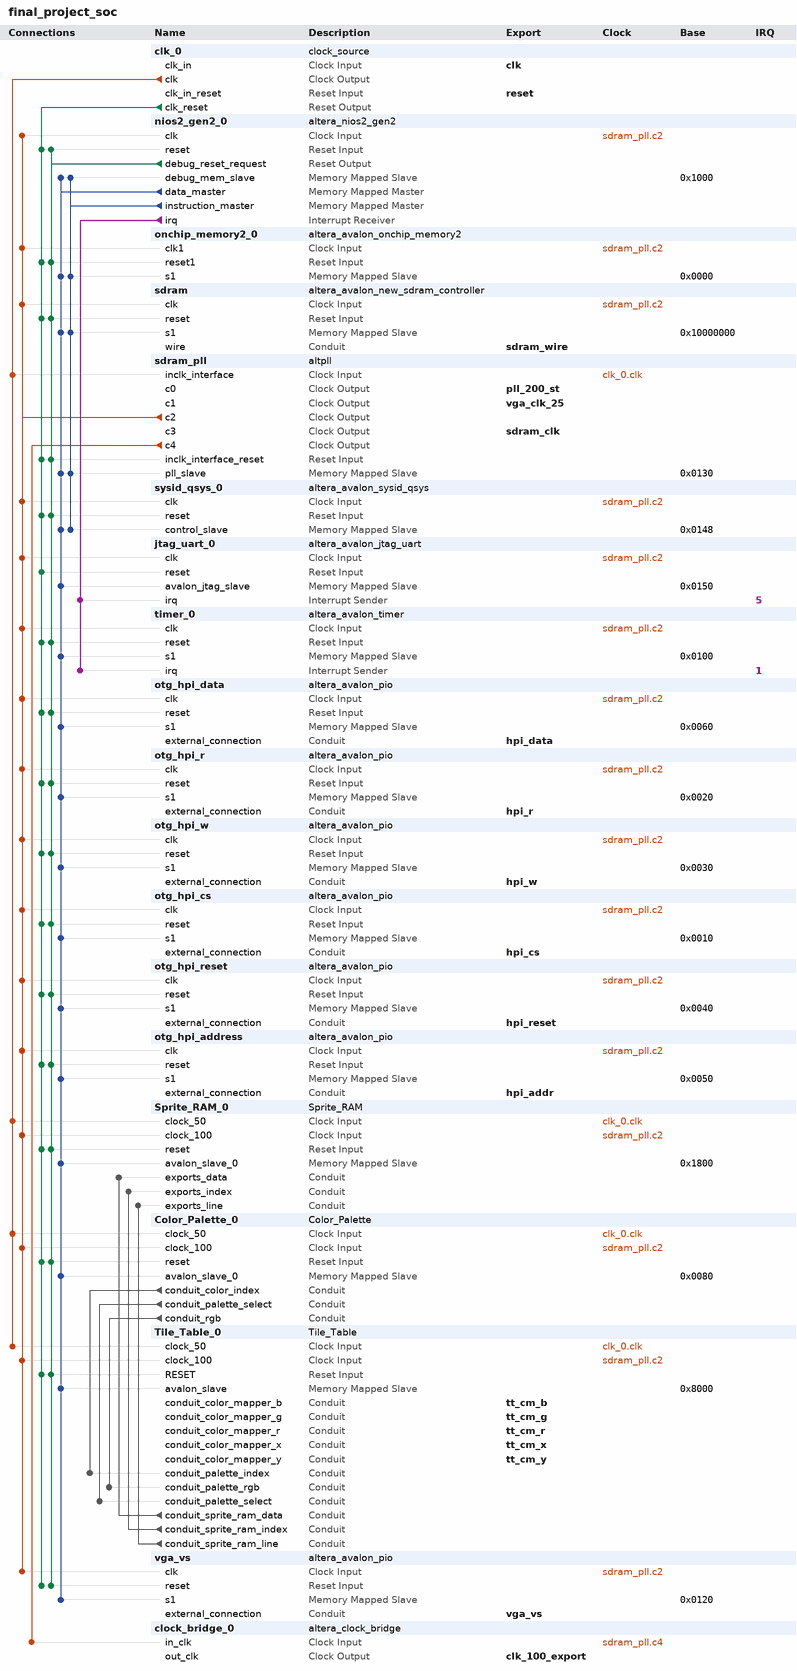
[diagram p0: system contents]
# Platform Designer (Qsys) system final_project_soc, Cyclone IV E EP4CE115F29C7
# Parameters at their usual value, and those the tool derives, are not listed.
package require -exact qsys 19.1
create_system final_project_soc
set_project_property DEVICE_FAMILY {Cyclone IV E}
set_project_property DEVICE EP4CE115F29C7

add_instance clk_0 clock_source 19.1
set_instance_parameter_value clk_0 clockFrequency 50000000

add_instance nios2_gen2_0 altera_nios2_gen2 19.1
set_instance_parameter_value nios2_gen2_0 dcache_size 2048
set_instance_parameter_value nios2_gen2_0 dividerType srt2
set_instance_parameter_value nios2_gen2_0 exceptionSlave sdram.s1
set_instance_parameter_value nios2_gen2_0 icache_size 4096
set_instance_parameter_value nios2_gen2_0 impl Fast
set_instance_parameter_value nios2_gen2_0 resetSlave sdram.s1

add_instance onchip_memory2_0 altera_avalon_onchip_memory2 19.1
set_instance_parameter_value onchip_memory2_0 dataWidth 32
set_instance_parameter_value onchip_memory2_0 dualPort false
set_instance_parameter_value onchip_memory2_0 initMemContent true
set_instance_parameter_value onchip_memory2_0 initializationFileName onchip_mem.hex
set_instance_parameter_value onchip_memory2_0 memorySize 16

add_instance sdram altera_avalon_new_sdram_controller 19.1
set_instance_parameter_value sdram TAC 5.5
set_instance_parameter_value sdram TRCD 20.0
set_instance_parameter_value sdram TRP 20.0
set_instance_parameter_value sdram casLatency 3
set_instance_parameter_value sdram columnWidth 10
set_instance_parameter_value sdram dataWidth 32
set_instance_parameter_value sdram generateSimulationModel false
set_instance_parameter_value sdram model single_Micron_MT48LC4M32B2_7_chip
set_instance_parameter_value sdram numberOfBanks 4
set_instance_parameter_value sdram numberOfChipSelects 1
set_instance_parameter_value sdram powerUpDelay 200.0
set_instance_parameter_value sdram refreshPeriod 7.8125
set_instance_parameter_value sdram rowWidth 13

add_instance sdram_pll altpll 19.1
set_instance_parameter_value sdram_pll CLK0_DIVIDE_BY 1
set_instance_parameter_value sdram_pll CLK0_MULTIPLY_BY 4
set_instance_parameter_value sdram_pll CLK1_DIVIDE_BY 2
set_instance_parameter_value sdram_pll CLK1_DUTY_CYCLE 50
set_instance_parameter_value sdram_pll CLK1_MULTIPLY_BY 1
set_instance_parameter_value sdram_pll CLK1_PHASE_SHIFT 0
set_instance_parameter_value sdram_pll CLK2_DIVIDE_BY 1
set_instance_parameter_value sdram_pll CLK2_DUTY_CYCLE 50
set_instance_parameter_value sdram_pll CLK2_MULTIPLY_BY 2
set_instance_parameter_value sdram_pll CLK2_PHASE_SHIFT 0
set_instance_parameter_value sdram_pll CLK3_DIVIDE_BY 1
set_instance_parameter_value sdram_pll CLK3_DUTY_CYCLE 50
set_instance_parameter_value sdram_pll CLK3_MULTIPLY_BY 2
set_instance_parameter_value sdram_pll CLK3_PHASE_SHIFT -1500
set_instance_parameter_value sdram_pll CLK4_DIVIDE_BY 1
set_instance_parameter_value sdram_pll CLK4_DUTY_CYCLE 50
set_instance_parameter_value sdram_pll CLK4_MULTIPLY_BY 2
set_instance_parameter_value sdram_pll CLK4_PHASE_SHIFT 0
set_instance_parameter_value sdram_pll INCLK0_INPUT_FREQUENCY 20000
set_instance_parameter_value sdram_pll PORT_ARESET PORT_UNUSED
set_instance_parameter_value sdram_pll PORT_LOCKED PORT_UNUSED
set_instance_parameter_value sdram_pll PORT_clk1 PORT_USED
set_instance_parameter_value sdram_pll PORT_clk2 PORT_USED
set_instance_parameter_value sdram_pll PORT_clk3 PORT_USED
set_instance_parameter_value sdram_pll PORT_clk4 PORT_USED

add_instance sysid_qsys_0 altera_avalon_sysid_qsys 19.1
set_instance_parameter_value sysid_qsys_0 id 0

add_instance jtag_uart_0 altera_avalon_jtag_uart 19.1
set_instance_parameter_value jtag_uart_0 simInteractiveOptions NO_INTERACTIVE_WINDOWS

add_instance timer_0 altera_avalon_timer 19.1
set_instance_parameter_value timer_0 period 1
set_instance_parameter_value timer_0 periodUnits MSEC

add_instance otg_hpi_data altera_avalon_pio 19.1
set_instance_parameter_value otg_hpi_data direction InOut
set_instance_parameter_value otg_hpi_data width 16

add_instance otg_hpi_r altera_avalon_pio 19.1
set_instance_parameter_value otg_hpi_r direction Output
set_instance_parameter_value otg_hpi_r width 1

add_instance otg_hpi_w altera_avalon_pio 19.1
set_instance_parameter_value otg_hpi_w direction Output
set_instance_parameter_value otg_hpi_w width 1

add_instance otg_hpi_cs altera_avalon_pio 19.1
set_instance_parameter_value otg_hpi_cs direction Output
set_instance_parameter_value otg_hpi_cs width 1

add_instance otg_hpi_reset altera_avalon_pio 19.1
set_instance_parameter_value otg_hpi_reset direction Output
set_instance_parameter_value otg_hpi_reset width 1

add_instance otg_hpi_address altera_avalon_pio 19.1
set_instance_parameter_value otg_hpi_address direction Output
set_instance_parameter_value otg_hpi_address width 2

add_instance Sprite_RAM_0 Sprite_RAM 1.0

add_instance Color_Palette_0 Color_Palette 1.0

add_instance Tile_Table_0 Tile_Table 1.0

add_instance vga_vs altera_avalon_pio 19.1
set_instance_parameter_value vga_vs captureEdge true
set_instance_parameter_value vga_vs direction Input
set_instance_parameter_value vga_vs width 1

add_instance clock_bridge_0 altera_clock_bridge 19.1
set_instance_parameter_value clock_bridge_0 DERIVED_CLOCK_RATE 100000000
set_instance_parameter_value clock_bridge_0 EXPLICIT_CLOCK_RATE 100000000

# connections
add_connection clk_0.clk Color_Palette_0.clock_50 clock
add_connection clk_0.clk sdram_pll.inclk_interface clock
add_connection clk_0.clk Sprite_RAM_0.clock_50 clock
add_connection clk_0.clk Tile_Table_0.clock_50 clock
add_connection sdram_pll.c2 Color_Palette_0.clock_100 clock
add_connection sdram_pll.c2 jtag_uart_0.clk clock
add_connection sdram_pll.c2 nios2_gen2_0.clk clock
add_connection sdram_pll.c2 onchip_memory2_0.clk1 clock
add_connection sdram_pll.c2 otg_hpi_address.clk clock
add_connection sdram_pll.c2 otg_hpi_cs.clk clock
add_connection sdram_pll.c2 otg_hpi_data.clk clock
add_connection sdram_pll.c2 otg_hpi_r.clk clock
add_connection sdram_pll.c2 otg_hpi_reset.clk clock
add_connection sdram_pll.c2 otg_hpi_w.clk clock
add_connection sdram_pll.c2 sdram.clk clock
add_connection sdram_pll.c2 Sprite_RAM_0.clock_100 clock
add_connection sdram_pll.c2 sysid_qsys_0.clk clock
add_connection sdram_pll.c2 Tile_Table_0.clock_100 clock
add_connection sdram_pll.c2 timer_0.clk clock
add_connection sdram_pll.c2 vga_vs.clk clock
add_connection sdram_pll.c4 clock_bridge_0.in_clk clock
add_connection clk_0.clk_reset Color_Palette_0.reset reset
add_connection clk_0.clk_reset jtag_uart_0.reset reset
add_connection clk_0.clk_reset nios2_gen2_0.reset reset
add_connection clk_0.clk_reset onchip_memory2_0.reset1 reset
add_connection clk_0.clk_reset otg_hpi_address.reset reset
add_connection clk_0.clk_reset otg_hpi_cs.reset reset
add_connection clk_0.clk_reset otg_hpi_data.reset reset
add_connection clk_0.clk_reset otg_hpi_r.reset reset
add_connection clk_0.clk_reset otg_hpi_reset.reset reset
add_connection clk_0.clk_reset otg_hpi_w.reset reset
add_connection clk_0.clk_reset sdram.reset reset
add_connection clk_0.clk_reset sdram_pll.inclk_interface_reset reset
add_connection clk_0.clk_reset Sprite_RAM_0.reset reset
add_connection clk_0.clk_reset sysid_qsys_0.reset reset
add_connection clk_0.clk_reset Tile_Table_0.RESET reset
add_connection clk_0.clk_reset timer_0.reset reset
add_connection clk_0.clk_reset vga_vs.reset reset
add_connection nios2_gen2_0.debug_reset_request Color_Palette_0.reset reset
add_connection nios2_gen2_0.debug_reset_request nios2_gen2_0.reset reset
add_connection nios2_gen2_0.debug_reset_request onchip_memory2_0.reset1 reset
add_connection nios2_gen2_0.debug_reset_request otg_hpi_address.reset reset
add_connection nios2_gen2_0.debug_reset_request otg_hpi_cs.reset reset
add_connection nios2_gen2_0.debug_reset_request otg_hpi_data.reset reset
add_connection nios2_gen2_0.debug_reset_request otg_hpi_r.reset reset
add_connection nios2_gen2_0.debug_reset_request otg_hpi_reset.reset reset
add_connection nios2_gen2_0.debug_reset_request otg_hpi_w.reset reset
add_connection nios2_gen2_0.debug_reset_request sdram.reset reset
add_connection nios2_gen2_0.debug_reset_request sdram_pll.inclk_interface_reset reset
add_connection nios2_gen2_0.debug_reset_request Sprite_RAM_0.reset reset
add_connection nios2_gen2_0.debug_reset_request sysid_qsys_0.reset reset
add_connection nios2_gen2_0.debug_reset_request Tile_Table_0.RESET reset
add_connection nios2_gen2_0.debug_reset_request timer_0.reset reset
add_connection nios2_gen2_0.debug_reset_request vga_vs.reset reset
add_connection nios2_gen2_0.data_master Color_Palette_0.avalon_slave_0 avalon
set_connection_parameter_value nios2_gen2_0.data_master/Color_Palette_0.avalon_slave_0 baseAddress 0x0080
add_connection nios2_gen2_0.data_master jtag_uart_0.avalon_jtag_slave avalon
set_connection_parameter_value nios2_gen2_0.data_master/jtag_uart_0.avalon_jtag_slave baseAddress 0x0150
add_connection nios2_gen2_0.data_master nios2_gen2_0.debug_mem_slave avalon
set_connection_parameter_value nios2_gen2_0.data_master/nios2_gen2_0.debug_mem_slave baseAddress 0x1000
add_connection nios2_gen2_0.data_master onchip_memory2_0.s1 avalon
set_connection_parameter_value nios2_gen2_0.data_master/onchip_memory2_0.s1 baseAddress 0x0000
add_connection nios2_gen2_0.data_master otg_hpi_address.s1 avalon
set_connection_parameter_value nios2_gen2_0.data_master/otg_hpi_address.s1 baseAddress 0x0050
add_connection nios2_gen2_0.data_master otg_hpi_cs.s1 avalon
set_connection_parameter_value nios2_gen2_0.data_master/otg_hpi_cs.s1 baseAddress 0x0010
add_connection nios2_gen2_0.data_master otg_hpi_data.s1 avalon
set_connection_parameter_value nios2_gen2_0.data_master/otg_hpi_data.s1 baseAddress 0x0060
add_connection nios2_gen2_0.data_master otg_hpi_r.s1 avalon
set_connection_parameter_value nios2_gen2_0.data_master/otg_hpi_r.s1 baseAddress 0x0020
add_connection nios2_gen2_0.data_master otg_hpi_reset.s1 avalon
set_connection_parameter_value nios2_gen2_0.data_master/otg_hpi_reset.s1 baseAddress 0x0040
add_connection nios2_gen2_0.data_master otg_hpi_w.s1 avalon
set_connection_parameter_value nios2_gen2_0.data_master/otg_hpi_w.s1 baseAddress 0x0030
add_connection nios2_gen2_0.data_master sdram.s1 avalon
set_connection_parameter_value nios2_gen2_0.data_master/sdram.s1 baseAddress 0x10000000
add_connection nios2_gen2_0.data_master sdram_pll.pll_slave avalon
set_connection_parameter_value nios2_gen2_0.data_master/sdram_pll.pll_slave baseAddress 0x0130
add_connection nios2_gen2_0.data_master Sprite_RAM_0.avalon_slave_0 avalon
set_connection_parameter_value nios2_gen2_0.data_master/Sprite_RAM_0.avalon_slave_0 baseAddress 0x1800
add_connection nios2_gen2_0.data_master sysid_qsys_0.control_slave avalon
set_connection_parameter_value nios2_gen2_0.data_master/sysid_qsys_0.control_slave baseAddress 0x0148
add_connection nios2_gen2_0.data_master Tile_Table_0.avalon_slave avalon
set_connection_parameter_value nios2_gen2_0.data_master/Tile_Table_0.avalon_slave baseAddress 0x8000
add_connection nios2_gen2_0.data_master timer_0.s1 avalon
set_connection_parameter_value nios2_gen2_0.data_master/timer_0.s1 baseAddress 0x0100
add_connection nios2_gen2_0.data_master vga_vs.s1 avalon
set_connection_parameter_value nios2_gen2_0.data_master/vga_vs.s1 baseAddress 0x0120
add_connection nios2_gen2_0.instruction_master nios2_gen2_0.debug_mem_slave avalon
set_connection_parameter_value nios2_gen2_0.instruction_master/nios2_gen2_0.debug_mem_slave baseAddress 0x1000
add_connection nios2_gen2_0.instruction_master onchip_memory2_0.s1 avalon
set_connection_parameter_value nios2_gen2_0.instruction_master/onchip_memory2_0.s1 baseAddress 0x0000
add_connection nios2_gen2_0.instruction_master sdram.s1 avalon
set_connection_parameter_value nios2_gen2_0.instruction_master/sdram.s1 baseAddress 0x10000000
add_connection nios2_gen2_0.instruction_master sdram_pll.pll_slave avalon
set_connection_parameter_value nios2_gen2_0.instruction_master/sdram_pll.pll_slave baseAddress 0x0130
add_connection nios2_gen2_0.instruction_master sysid_qsys_0.control_slave avalon
set_connection_parameter_value nios2_gen2_0.instruction_master/sysid_qsys_0.control_slave baseAddress 0x0148
add_connection Color_Palette_0.conduit_color_index Tile_Table_0.conduit_palette_index conduit
add_connection Color_Palette_0.conduit_palette_select Tile_Table_0.conduit_palette_select conduit
add_connection Color_Palette_0.conduit_rgb Tile_Table_0.conduit_palette_rgb conduit
add_connection Tile_Table_0.conduit_sprite_ram_data Sprite_RAM_0.exports_data conduit
add_connection Tile_Table_0.conduit_sprite_ram_index Sprite_RAM_0.exports_index conduit
add_connection Tile_Table_0.conduit_sprite_ram_line Sprite_RAM_0.exports_line conduit
add_connection nios2_gen2_0.irq jtag_uart_0.irq interrupt
set_connection_parameter_value nios2_gen2_0.irq/jtag_uart_0.irq irqNumber 5
add_connection nios2_gen2_0.irq timer_0.irq interrupt
set_connection_parameter_value nios2_gen2_0.irq/timer_0.irq irqNumber 1

# exported interfaces
add_interface clk clock sink
set_interface_property clk EXPORT_OF clk_0.clk_in
add_interface clk_100_export clock source
set_interface_property clk_100_export EXPORT_OF clock_bridge_0.out_clk
add_interface hpi_addr conduit end
set_interface_property hpi_addr EXPORT_OF otg_hpi_address.external_connection
add_interface hpi_cs conduit end
set_interface_property hpi_cs EXPORT_OF otg_hpi_cs.external_connection
add_interface hpi_data conduit end
set_interface_property hpi_data EXPORT_OF otg_hpi_data.external_connection
add_interface hpi_r conduit end
set_interface_property hpi_r EXPORT_OF otg_hpi_r.external_connection
add_interface hpi_reset conduit end
set_interface_property hpi_reset EXPORT_OF otg_hpi_reset.external_connection
add_interface hpi_w conduit end
set_interface_property hpi_w EXPORT_OF otg_hpi_w.external_connection
add_interface pll_200_st clock source
set_interface_property pll_200_st EXPORT_OF sdram_pll.c0
add_interface reset reset sink
set_interface_property reset EXPORT_OF clk_0.clk_in_reset
add_interface sdram_clk clock source
set_interface_property sdram_clk EXPORT_OF sdram_pll.c3
add_interface sdram_wire conduit end
set_interface_property sdram_wire EXPORT_OF sdram.wire
add_interface tt_cm_b conduit end
set_interface_property tt_cm_b EXPORT_OF Tile_Table_0.conduit_color_mapper_b
add_interface tt_cm_g conduit end
set_interface_property tt_cm_g EXPORT_OF Tile_Table_0.conduit_color_mapper_g
add_interface tt_cm_r conduit end
set_interface_property tt_cm_r EXPORT_OF Tile_Table_0.conduit_color_mapper_r
add_interface tt_cm_x conduit end
set_interface_property tt_cm_x EXPORT_OF Tile_Table_0.conduit_color_mapper_x
add_interface tt_cm_y conduit end
set_interface_property tt_cm_y EXPORT_OF Tile_Table_0.conduit_color_mapper_y
add_interface vga_clk_25 clock source
set_interface_property vga_clk_25 EXPORT_OF sdram_pll.c1
add_interface vga_vs conduit end
set_interface_property vga_vs EXPORT_OF vga_vs.external_connection

set_interconnect_requirement {$system} qsys_mm.clockCrossingAdapter HANDSHAKE
set_interconnect_requirement {$system} qsys_mm.enableEccProtection FALSE
set_interconnect_requirement {$system} qsys_mm.insertDefaultSlave FALSE
set_interconnect_requirement {$system} qsys_mm.maxAdditionalLatency 1

save_system final_project_soc.qsys
